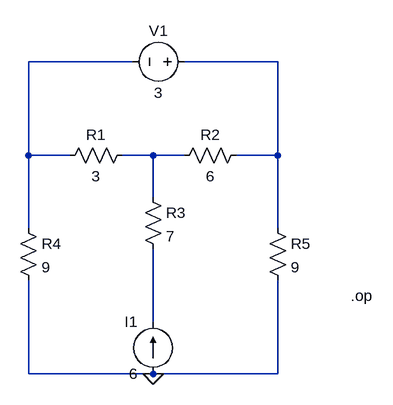
[diagram p0: schematic Draft2.asc]
Draft2.asc, the LTspice schematic file:
Version 4
SHEET 1 880 680
WIRE 192 -48 32 -48
WIRE 416 -48 272 -48
WIRE 32 96 32 -48
WIRE 96 96 32 96
WIRE 224 96 176 96
WIRE 272 96 224 96
WIRE 416 96 416 -48
WIRE 416 96 352 96
WIRE 224 160 224 96
WIRE 32 208 32 96
WIRE 416 208 416 96
WIRE 224 352 224 240
WIRE 32 432 32 288
WIRE 224 432 32 432
WIRE 416 432 416 288
WIRE 416 432 224 432
FLAG 224 432 0
SYMBOL voltage 288 -48 R90
WINDOW 0 -32 56 VBottom 2
WINDOW 3 32 56 VTop 2
WINDOW 123 0 0 Left 0
WINDOW 39 0 0 Left 0
SYMATTR InstName V1
SYMATTR Value 3
SYMBOL res 192 80 R90
WINDOW 0 0 56 VBottom 2
WINDOW 3 32 56 VTop 2
SYMATTR InstName R1
SYMATTR Value 3
SYMBOL res 368 80 R90
WINDOW 0 0 56 VBottom 2
WINDOW 3 32 56 VTop 2
SYMATTR InstName R2
SYMATTR Value 6
SYMBOL res 208 144 R0
SYMATTR InstName R3
SYMATTR Value 7
SYMBOL res 16 192 R0
SYMATTR InstName R4
SYMATTR Value 9
SYMBOL res 400 192 R0
SYMATTR InstName R5
SYMATTR Value 9
SYMBOL current 224 432 R180
WINDOW 0 24 80 Left 2
WINDOW 3 24 0 Left 2
WINDOW 123 0 0 Left 0
WINDOW 39 0 0 Left 0
SYMATTR InstName I1
SYMATTR Value 6
TEXT 528 312 Left 2 !.op

The netlist it stands for:
* Draft2.asc
V1 N002 N001 3
R1 N003 N001 3
R2 N002 N003 6
R3 N003 N004 7
R4 N001 0 9
R5 N002 0 9
I1 0 N004 6
.op
.backanno
.end